# EAGLE schematic CM FT4232 with RS485 and ESP32 (EAGLE 9.6.2)
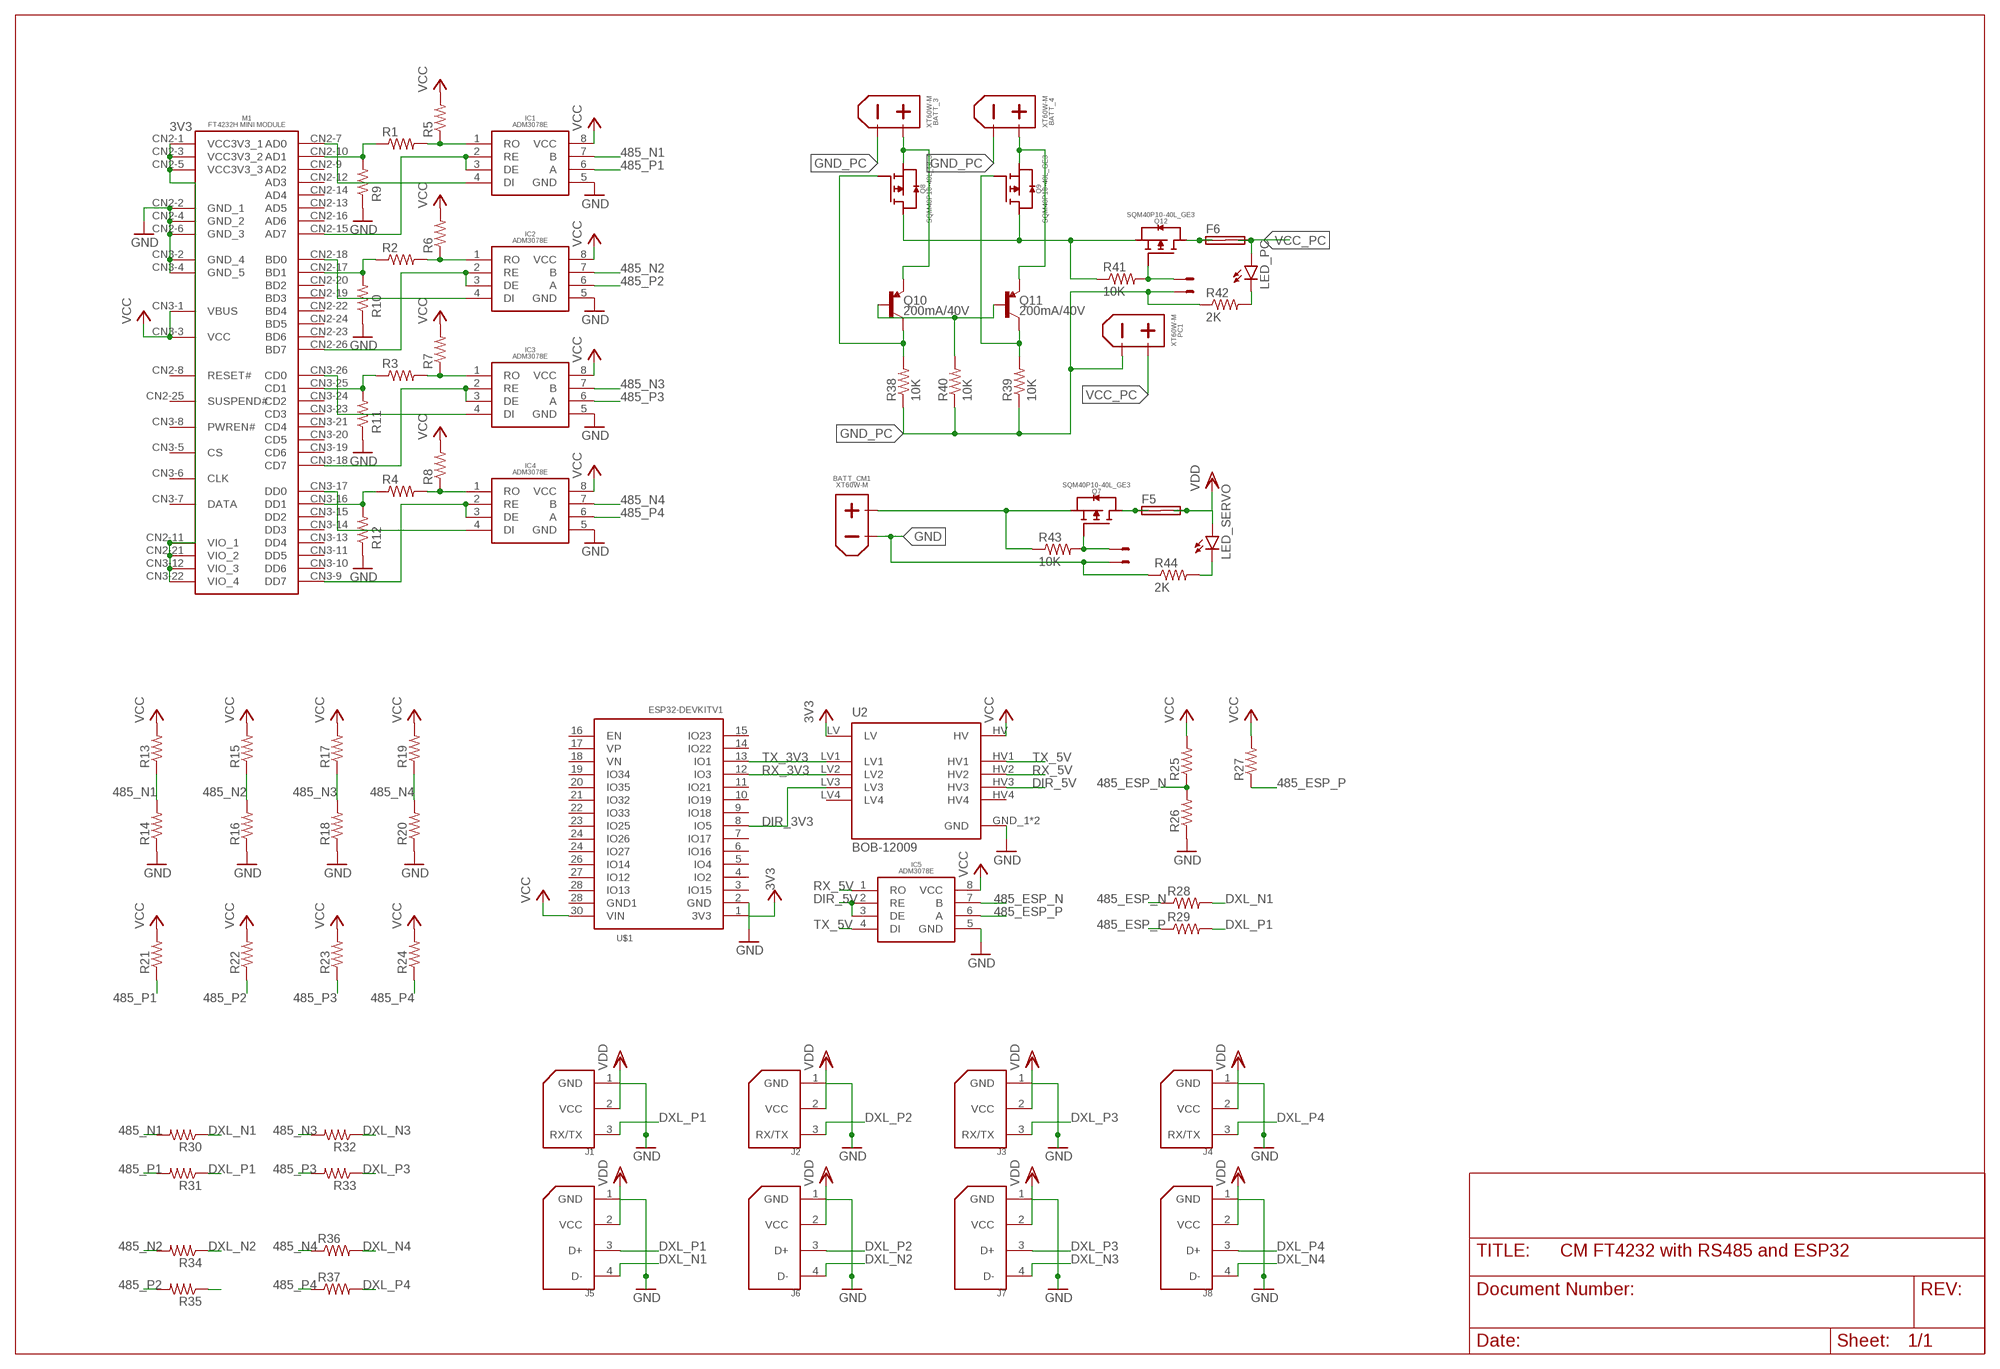
[diagram p0: schematic, sheet 1]

## Parts
BATT_3  XT60PW-M  [XT60PW-M]
BATT_4  XT60PW-M  [XT60PW-M]
BATT_CM1  XT60PW-M  [XT60PW-M]
F5  SHK20L  [SHK20L]
F6  SHK20L  [SHK20L]
IC1  ADM3078E  [ADM3078E]
IC2  ADM3078E  [ADM3078E]
IC3  ADM3078E  [ADM3078E]
IC4  ADM3078E  [ADM3078E]
IC5  ADM3078E  [ADM3078E]
J1  22-03-5035  [5267-3]
J2  22-03-5035  [5267-3]
J3  22-03-5035  [5267-3]
J4  22-03-5035  [5267-3]
J5  22-03-5045  [5267-4]
J6  22-03-5045  [5267-4]
J7  22-03-5045  [5267-4]
J8  22-03-5045  [5267-4]
LED_PC  LEDCHIPLED_0805  [CHIPLED_0805]
LED_SERVO  LEDCHIPLED_0805  [CHIPLED_0805]
M1  FT4232H_MINI_MODULE  [FT4232H_MINI_MODULE]
PC1  XT60PW-M  [XT60PW-M]
Q7  SQM40P10-40L_GE3  [TO-252-3]
Q8  SQM40P10-40L_GE3  [TO-252-3]
Q9  SQM40P10-40L_GE3  [TO-252-3]
Q10  200mA/40V  TRANS_PNP-PMBT3906|MMBT3906L  [SOT23-3]
Q11  200mA/40V  TRANS_PNP-PMBT3906|MMBT3906L  [SOT23-3]
Q12  SQM40P10-40L_GE3  [TO-252-3]
R1  RESISTOR0805  [0805]
R2  RESISTOR0805  [0805]
R3  RESISTOR0805  [0805]
R4  RESISTOR0805  [0805]
R5  RESISTOR0805  [0805]
R6  RESISTOR0805  [0805]
R7  RESISTOR0805  [0805]
R8  RESISTOR0805  [0805]
R9  RESISTOR0805  [0805]
R10  RESISTOR0805  [0805]
R11  RESISTOR0805  [0805]
R12  RESISTOR0805  [0805]
R13  RESISTOR0805  [0805]
R14  RESISTOR0805  [0805]
R15  RESISTOR0805  [0805]
R16  RESISTOR0805  [0805]
R17  RESISTOR0805  [0805]
R18  RESISTOR0805  [0805]
R19  RESISTOR0805  [0805]
R20  RESISTOR0805  [0805]
R21  RESISTOR0805  [0805]
R22  RESISTOR0805  [0805]
R23  RESISTOR0805  [0805]
R24  RESISTOR0805  [0805]
R25  RESISTOR0805  [0805]
R26  RESISTOR0805  [0805]
R27  RESISTOR0805  [0805]
R28  RESISTOR0805  [0805]
R29  RESISTOR0805  [0805]
R30  RESISTOR0805  [0805]
R31  RESISTOR0805  [0805]
R32  RESISTOR0805  [0805]
R33  RESISTOR0805  [0805]
R34  RESISTOR0805  [0805]
R35  RESISTOR0805  [0805]
R36  RESISTOR0805  [0805]
R37  RESISTOR0805  [0805]
R38  10K  R-US_M0805  [M0805]
R39  10K  R-US_M0805  [M0805]
R40  10K  R-US_M0805  [M0805]
R41  10K  R-US_M0805  [M0805]
R42  2K  R-US_M0805  [M0805]
R43  10K  R-US_M0805  [M0805]
R44  2K  R-US_M0805  [M0805]
U2  BOB-12009  [CONV_BOB-12009]
U$1  ESP32DEVKITV1  [ESP32-DEVKITV1]
X7  22-23-2021  [22-23-2021]
X8  22-23-2021  [22-23-2021]

## Nets
3V3: M1.CN2-1(VCC3V3_1) M1.CN2-3(VCC3V3_2) M1.CN2-5(VCC3V3_3) M1.CN2-11(VIO_1) M1.CN2-21(VIO_2) M1.CN3-12(VIO_3) M1.CN3-22(VIO_4) U2.LV U$1.1(3V3) ; supply symbol labelled VCC
485_ESP_N: IC5.7(B) R25.1 R26.2 R28.1
485_ESP_P: IC5.6(A) R27.1 R29.1
485_N1: IC1.7(B) R13.1 R14.2 R30.2
485_N2: IC2.7(B) R15.1 R16.2 R34.2
485_N3: IC3.7(B) R17.1 R18.2 R32.2
485_N4: IC4.7(B) R19.1 R20.2 R36.1
485_P1: IC1.6(A) R21.1 R31.2
485_P2: IC2.6(A) R22.1 R35.2
485_P3: IC3.6(A) R23.1 R33.2
485_P4: IC4.6(A) R24.1 R37.1
+2: BATT_CM1.+ Q7.3(S) R43.1
+3: Q8.4(D) Q9.4(D) Q12.3(S) R41.1
DI1: IC1.4(DI) M1.CN2-7(AD0)
DIR_3V3: U2.LV3 U$1.8(IO5)
DIR_5V: IC5.2(RE) IC5.3(DE) U2.HV3
DRAIN2: F5.1A F5.1B Q7.4(D)
DRAIN3: F6.1A F6.1B Q12.4(D)
DXL_N1: J5.4(D-) R28.2 R30.1
DXL_N2: J6.4(D-) R34.1
DXL_N3: J7.4(D-) R32.1
DXL_N4: J8.4(D-) R36.2
DXL_P1: J1.3(RX/TX) J5.3(D+) R29.2 R31.1
DXL_P2: J2.3(RX/TX) J6.3(D+) R35.1
DXL_P3: J3.3(RX/TX) J7.3(D+) R33.1
DXL_P4: J4.3(RX/TX) J8.3(D+) R37.2
GND: BATT_CM1.1(-) BATT_CM1.2(-) BATT_CM1.- IC1.5(GND) IC2.5(GND) IC3.5(GND) IC4.5(GND) IC5.5(GND) J1.1(GND) J2.1(GND) J3.1(GND) J4.1(GND) J5.1(GND) J6.1(GND) J7.1(GND) J8.1(GND) M1.CN2-2(GND_1) M1.CN2-4(GND_2) M1.CN2-6(GND_3) M1.CN3-2(GND_4) M1.CN3-4(GND_5) R9.1 R10.1 R11.1 R12.1 R14.1 R16.1 R18.1 R20.1 R26.1 R44.1 U2.GND_1(GND) U2.GND_2(GND) U$1.2(GND) X7.2
GND_PC: BATT_3.1(-) BATT_3.2(-) BATT_3.- BATT_4.1(-) BATT_4.2(-) BATT_4.- PC1.1(-) PC1.2(-) PC1.- R38.1 R39.1 R40.1 R42.1 X8.2
N$2: IC2.2(RE) IC2.3(DE) M1.CN2-26(BD7)
N$3: IC3.2(RE) IC3.3(DE) M1.CN3-18(CD7)
N$4: IC4.2(RE) IC4.3(DE) M1.CN3-9(DD7)
N$5: M1.CN2-10(AD1) R1.1 R9.2
N$7: M1.CN2-17(BD1) R2.1 R10.2
N$8: IC2.1(RO) R2.2 R6.1
N$9: IC3.1(RO) R3.2 R7.1
N$10: M1.CN3-25(CD1) R3.1 R11.2
N$11: M1.CN3-16(DD1) R4.1 R12.2
N$12: IC4.1(RO) R4.2 R8.1
N$14: IC2.4(DI) M1.CN2-18(BD0)
N$15: IC3.4(DI) M1.CN3-26(CD0)
N$16: IC4.4(DI) M1.CN3-17(DD0)
N$17: BATT_3.+ Q8.3(S) Q10.2(E)
N$18: BATT_4.+ Q9.3(S) Q11.2(E)
N$19: Q8.1(G) Q10.3(C) R38.2
N$20: Q9.1(G) Q11.3(C) R39.2
N$22: Q10.1(B) Q11.1(B) R40.2
N$23: Q12.1(G) R41.2 X8.1
N$24: Q7.1(G) R43.2 X7.1
N$25: LED_PC.C R42.2
N$26: LED_SERVO.C R44.2
RE1: IC1.2(RE) IC1.3(DE) M1.CN2-15(AD7)
RO1: IC1.1(RO) R1.2 R5.1
RX_3V3: U2.LV2 U$1.12(IO3)
RX_5V: IC5.1(RO) U2.HV2
TX_3V3: U2.LV1 U$1.13(IO1)
TX_5V: IC5.4(DI) U2.HV1
VCC: IC1.8(VCC) IC2.8(VCC) IC3.8(VCC) IC4.8(VCC) IC5.8(VCC) M1.CN3-1(VBUS) M1.CN3-3(VCC) R5.2 R6.2 R7.2 R8.2 R13.2 R15.2 R17.2 R19.2 R21.2 R22.2 R23.2 R24.2 R25.2 R27.2 U2.HV U$1.30(VIN)
VCC_PC: F6.2A F6.2B LED_PC.A PC1.+
VDD: F5.2A F5.2B J1.2(VCC) J2.2(VCC) J3.2(VCC) J4.2(VCC) J5.2(VCC) J6.2(VCC) J7.2(VCC) J8.2(VCC) LED_SERVO.A
Unconnected: M1.CN2-8(RESET#) M1.CN2-9(AD2) M1.CN2-12(AD3) M1.CN2-13(AD5) M1.CN2-14(AD4) M1.CN2-16(AD6) M1.CN2-19(BD3) M1.CN2-20(BD2) M1.CN2-22(BD4) M1.CN2-23(BD6) M1.CN2-24(BD5) M1.CN2-25(SUSPEND#) M1.CN3-5(CS) M1.CN3-6(CLK) M1.CN3-7(DATA) M1.CN3-8(PWREN#) M1.CN3-10(DD6) M1.CN3-11(DD5) M1.CN3-13(DD4) M1.CN3-14(DD3) M1.CN3-15(DD2) M1.CN3-19(CD6) M1.CN3-20(CD5) M1.CN3-21(CD4) M1.CN3-23(CD3) M1.CN3-24(CD2) U2.HV4 U2.LV4 U$1.3(IO15) U$1.4(IO2) U$1.5(IO4) U$1.6(IO16) U$1.7(IO17) U$1.9(IO18) U$1.10(IO19) U$1.11(IO21) U$1.14(IO22) U$1.15(IO23) U$1.16(EN) U$1.17(VP) U$1.18(VN) U$1.19(IO34) U$1.20(IO35) U$1.21(IO32) U$1.22(IO33) U$1.23(IO25) U$1.24(IO26) U$1.24(IO27) U$1.26(IO14) U$1.27(IO12) U$1.28(GND1) U$1.28(IO13)

## Library data of the parts
BATT_3 BATT_4 BATT_CM1 PC1 = AMASS_XT60:XT60PW-M
F5 F6 = fuse:SHK20L: FUSE HOLDER 5 x 20 mm, SH contact, SHH1 Schukat, E1073 Buerklin; OC_FARNELL: unknown; OC_NEWARK: unknown
IC1-IC5 = ADM3078E:ADM3078E
J1-J4 = molex:22-03-5035: Molex SPOX Vert, Tin (Dynamixel AX/MX Bus) tested: YES (arbotix)
J5-J8 = molex:22-03-5045: Molex SPOX Vert, Tin (Dynamixel RX Bus) tested: YES (arbotix2)
LED_PC LED_SERVO = led:LED: LED OSRAM: - CHIPLED LG R971, LG N971, LY N971, LG Q971, LY Q971, LO R971, LY R971 LH N974, LH R974 LS Q976, LO Q976, LY Q976 LO Q996 - Hyper CHIPLED LW Q18S LB Q993, LB Q99A, LB R99A - SideLED LS A670, LO A670, LY A670, LG A670, LP A670 LB A673, LV A673, LT A673, LW A673 LH A674 LY A675 LS A676, LA A676, LO A676, LY A676, LW A676 LS A679, LY A679, LG A679 - Hyper Micro SIDELED® LS Y876, LA Y876, LO Y876, LY Y876 LT Y87S - SmartLED LW L88C, LW L88S LB L89C, LB L89S, LG L890 LS L89K, LO L89K, LY L89K LS L896, LA L896, LO L896, LY L896 - TOPLED LS T670, LO T670, LY T670, LG T670, LP T670 LSG T670, LSP T670, LSY T670, LOP T670, LYG T670 LG T671, LOG T671, LSG T671 LB T673, LV T673, LT T673, LW T673 LH T674 LS T676, LA T676, LO T676, LY T676, LB T676, LH T676, LSB T676, LW T676 LB T67C, LV T67C, LT T67C, LS T67K, LO T67K, LY T67K, LW E67C LS E67B, LA E67B, LO E67B, LY E67B, LB E67C, LV E67C, LT E67C LW T67C LS T679, LY T679, LG T679 LS T770, LO T770, LY T770, LG T770, LP T770 LB T773, LV T773, LT T773, LW T773 LH T774 LS E675, LA E675, LY E675, LS T675 LS T776, LA T776, LO T776, LY T776, LB T776 LHGB T686 LT T68C, LB T68C - Hyper Mini TOPLED® LB M676 - Mini TOPLED Santana® LG M470 LS M47K, LO M47K, LY M47K Source: http://www.osram.convergy.de LUXEON: - LUMILED® LXK2-PW12-R00, LXK2-PW12-S00, LXK2-PW14-U00, LXK2-PW14-V00 LXK2-PM12-R00, LXK2-PM12-S00, LXK2-PM14-U00 LXK2-PE12-Q00, LXK2-PE12-R00, LXK2-PE12-S00, LXK2-PE14-T00, LXK2-PE14-U00 LXK2-PB12-K00, LXK2-PB12-L00, LXK2-PB12-M00, LXK2-PB14-N00, LXK2-PB14-P00, LXK2-PB14-Q00 LXK2-PR12-L00, LXK2-PR12-M00, LXK2-PR14-Q00, LXK2-PR14-R00 LXK2-PD12-Q00, LXK2-PD12-R00, LXK2-PD12-S00 LXK2-PH12-R00, LXK2-PH12-S00 LXK2-PL12-P00, LXK2-PL12-Q00, LXK2-PL12-R00 Source: www.luxeon.com KINGBRIGHT: KA-3528ASYC Source: www.kingbright.com
M1 = FT4232H_MINI_MODULE:FT4232H_MINI_MODULE
Q7-Q9 Q12 = Vishay_FET:SQM40P10-40L_GE3
Q10 Q11 = SparkFun-DiscreteSemi:TRANS_PNP: PNP transistor Current controlled devices typically used to amplify current or used as a switch. SparkFun Products: SparkFun Serial Enabled 16x2 LCD - Red on Black <https://www.sparkfun.com/products/9068> SparkFun Logomatic <https://www.sparkfun.com/products/12772>; PROD_ID: TRANS-08052
R1-R37 = SparkFun-Resistors:RESISTOR: Generic Resistor Package
R38-R44 = rcl:R-US_: RESISTOR, American symbol; SPICEPREFIX: R
U2 = BOB-12009:BOB-12009: Logic Level Converter - Bi-Direc Check availability <https://pricing.snapeda.com/parts/BOB-12009/SparkFun/view-part?ref=eda>; AVAILABILITY: In Stock; DESCRIPTION: BSS138 Logic-Level Translator Interface Evaluation Board; MF: SparkFun; MP: BOB-12009; PACKAGE: None; PRICE: None; PURCHASE-URL: https://pricing.snapeda.com/search/part/BOB-12009/?ref=eda
U$1 = ESP32-DEVKITV1:ESP32DEVKITV1
X7 X8 = con-molex:22-23-2021: .100" (2.54mm) Center Header - 2 Pin; MF: MOLEX; MPN: 22-23-2021; OC_FARNELL: 1462926; OC_NEWARK: 25C3832

## Net classes
4 Battery-Power: width 2.54 mm, drill 1.27 mm, clearance 0.203 mm